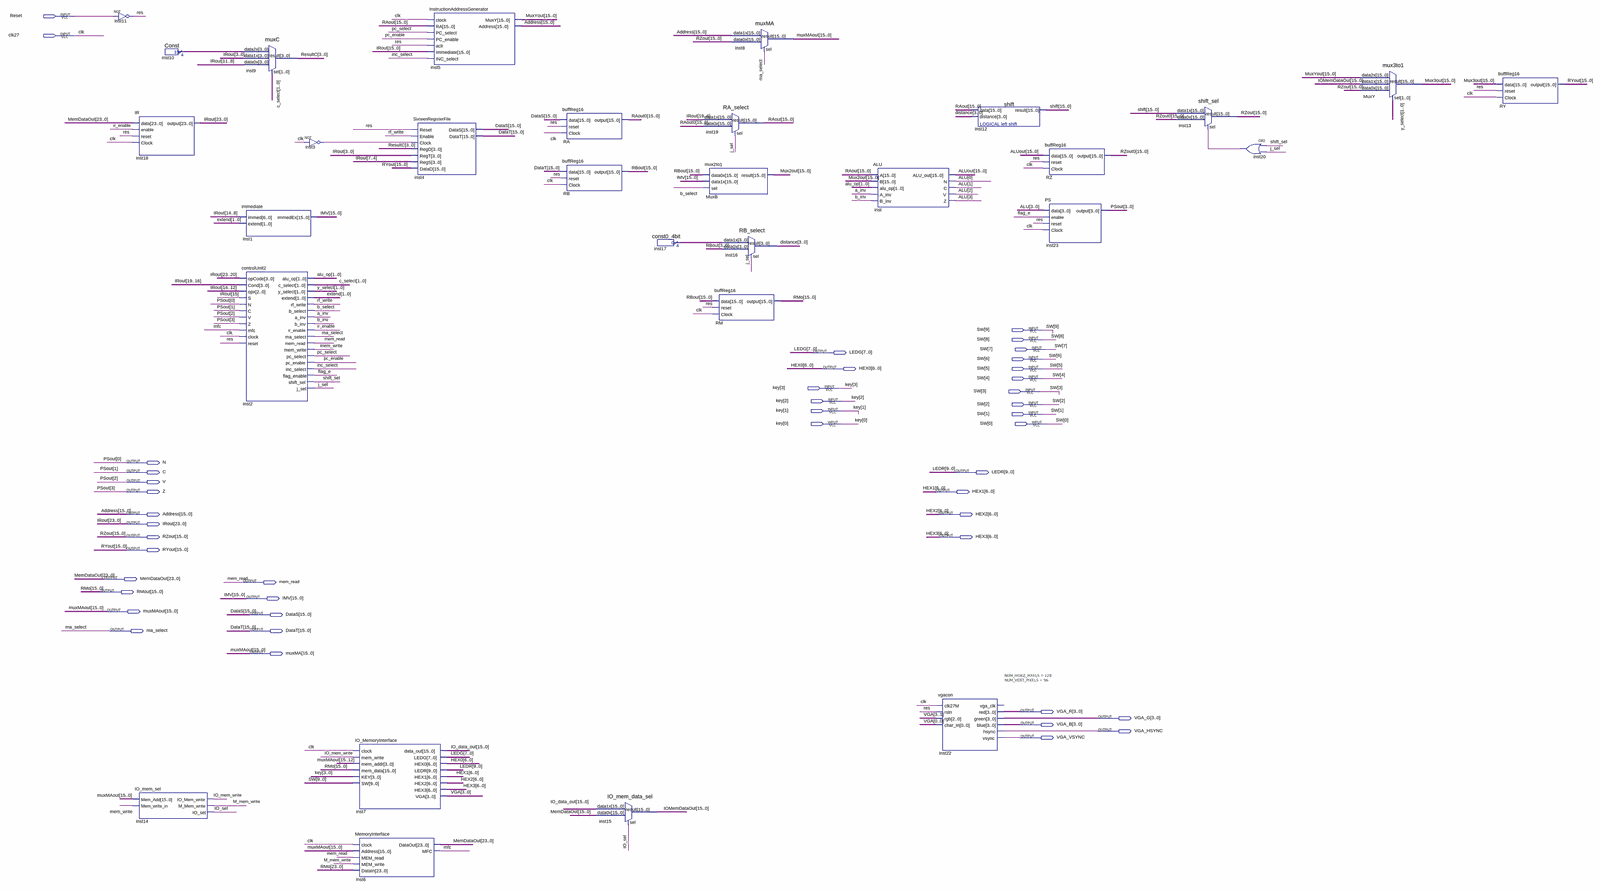
[diagram p0: schematic sheet, whole]
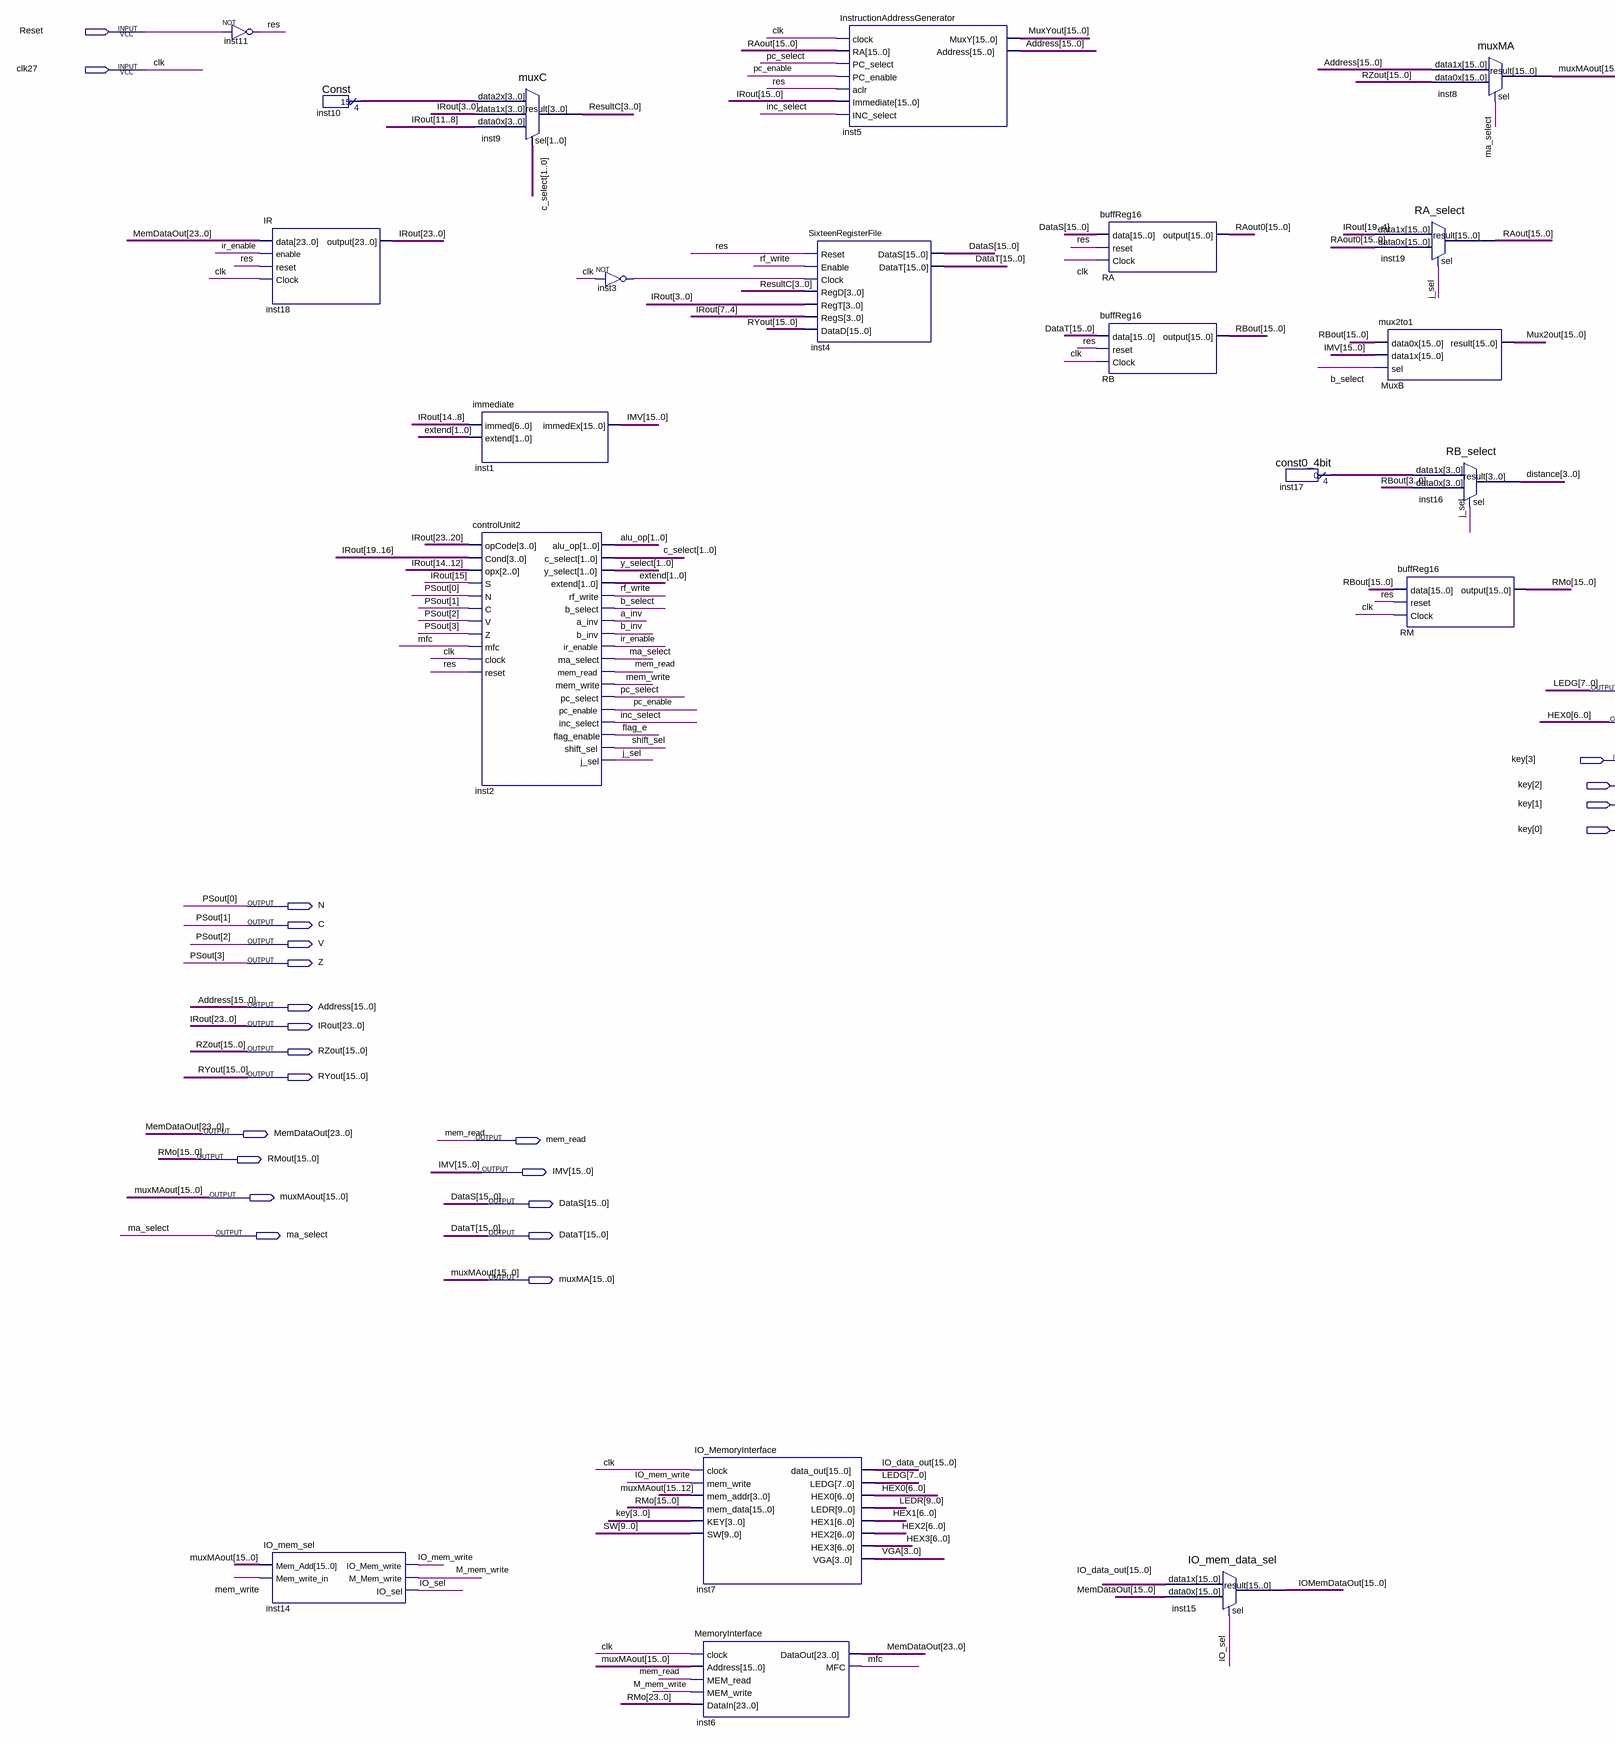
[diagram p1: schematic sheet, left part]
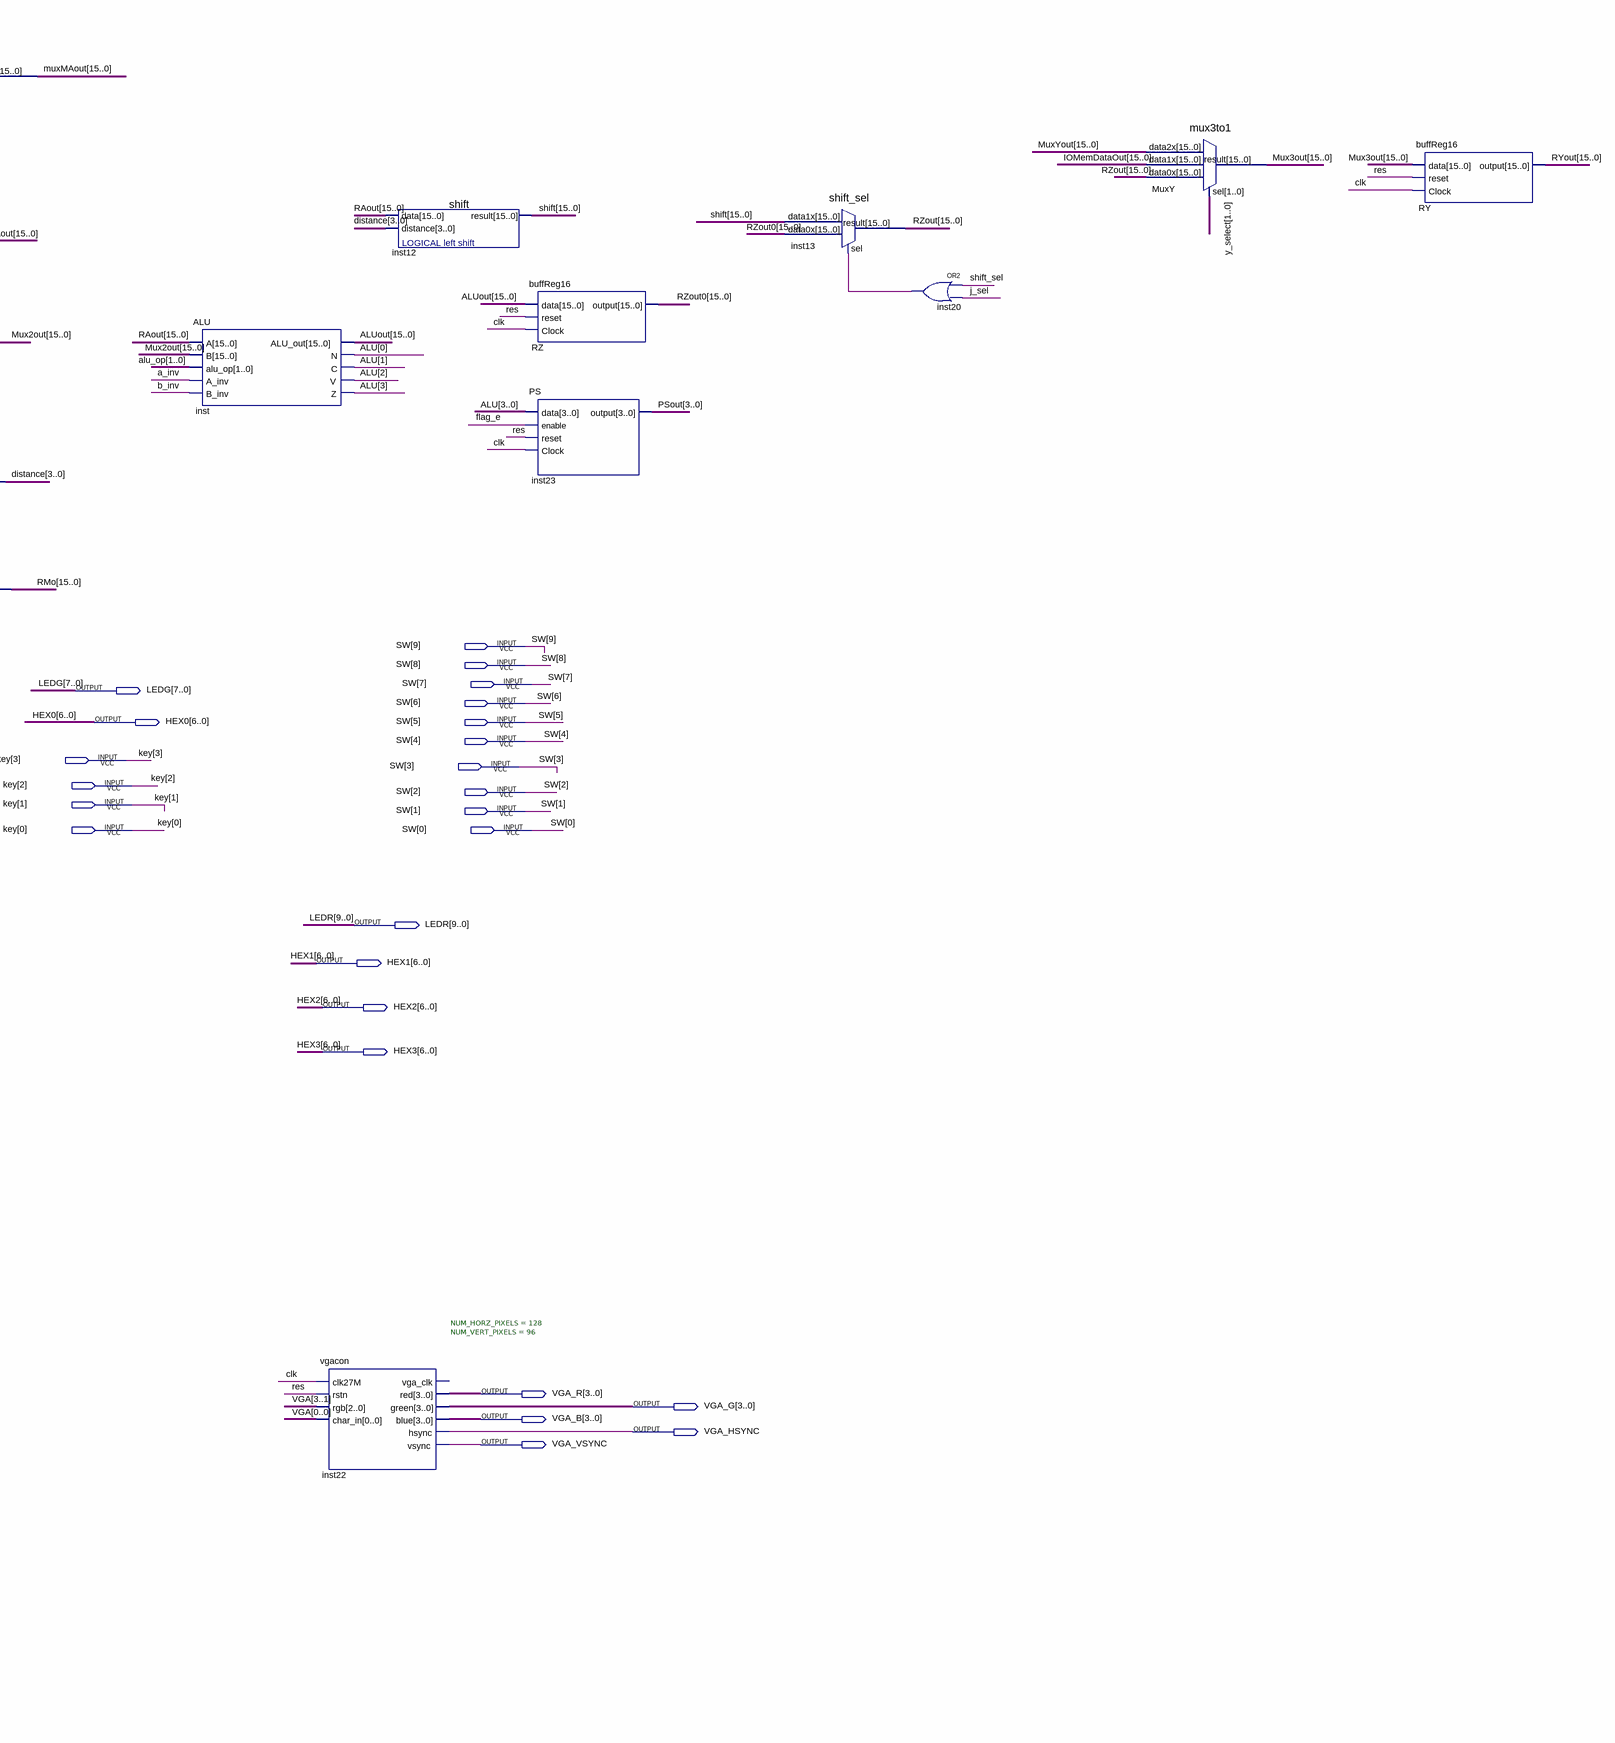
[diagram p2: schematic sheet, right part]
// Quartus schematic Part3.bdf as structural Verilog: 30 symbols, 44 pins
module Part3 (
  input  Reset,
  input  clk27,
  input  [9:0] SW,
  input  [3:0] key,
  output [7:0] LEDG,
  output [6:0] HEX0,
  output N,
  output C,
  output [9:0] LEDR,
  output V,
  output Z,
  output [6:0] HEX1,
  output [15:0] Address,
  output [6:0] HEX2,
  output [23:0] IRout,
  output [15:0] RZout,
  output [6:0] HEX3,
  output [15:0] RYout,
  output [23:0] MemDataOut,
  output mem_read,
  output [15:0] RMout,
  output [15:0] IMV,
  output [15:0] muxMAout,
  output [15:0] DataS,
  output ma_select,
  output [15:0] DataT,
  output [15:0] muxMA,
  output [3:0] VGA_R,
  output [3:0] VGA_G,
  output [3:0] VGA_B,
  output VGA_HSYNC,
  output VGA_VSYNC
);

  wire a_inv, b_inv, b_select, flag_e, inc_select, inst3_out, inst20_out, IO_mem_write, IO_sel, ir_enable,
       j_sel, M_mem_write, mem_write, mfc, pc_enable, pc_select, res, rf_write, shift_sel;
  wire [1:0] alu_op, c_select, extend, y_select;
  wire [3:0] ALU, distance, inst10_result, inst17_result, ResultC, VGA;
  wire [15:0] ALUout, IO_data_out, IOMemDataOut, Mux2out, Mux3out, MuxYout, RAout, RAout0, RBout, RZout0,
       shift;
  wire [23:16] RMo;

  not inst11 (res, Reset);
  IR inst18 (.data(MemDataOut), .enable(ir_enable), .reset(res), .Clock(clk27), .\output (IRout));
  IO_mem_sel inst14 (
    .Mem_Add(muxMA), .Mem_write_in(mem_write), .IO_Mem_write(IO_mem_write), .M_Mem_write(M_mem_write),
    .IO_sel(IO_sel));
  Const inst10 (.result(inst10_result));
  muxC inst9 (.data2x(inst10_result), .data1x(IRout[3:0]), .data0x(IRout[11:8]), .sel(c_select), .result(ResultC));
  immediate inst1 (.immed(IRout[14:8]), .extend(extend), .immedEx(IMV));
  controlUnit2 inst2 (
    .opCode(IRout[23:20]), .Cond(IRout[19:16]), .opx(IRout[14:12]), .S(IRout[15]), .N(N), .C(C), .V(V),
    .Z(Z), .mfc(mfc), .clock(clk27), .reset(res), .alu_op(alu_op), .c_select(c_select), .y_select(y_select),
    .extend(extend), .rf_write(rf_write), .b_select(b_select), .a_inv(a_inv), .b_inv(b_inv),
    .ir_enable(ir_enable), .ma_select(ma_select), .mem_read(mem_read), .mem_write(mem_write),
    .pc_select(pc_select), .pc_enable(pc_enable), .inc_select(inc_select), .flag_enable(flag_e),
    .shift_sel(shift_sel), .j_sel(j_sel));
  not inst3 (inst3_out, clk27);
  IO_MemoryInterface inst7 (
    .clock(clk27), .mem_write(IO_mem_write), .mem_addr(muxMA[15:12]), .mem_data(RMout), .KEY(key), .SW(SW),
    .data_out(IO_data_out), .LEDG(LEDG), .HEX0(HEX0), .LEDR(LEDR), .HEX1(HEX1), .HEX2(HEX2), .HEX3(HEX3),
    .VGA(VGA));
  MemoryInterface inst6 (
    .clock(clk27), .Address(muxMA), .MEM_read(mem_read), .MEM_write(M_mem_write), .DataIn({RMo, RMout}),
    .DataOut(MemDataOut), .MFC(mfc));
  SixteenRegisterFile inst4 (
    .Reset(res), .Enable(rf_write), .Clock(inst3_out), .RegD(ResultC), .RegT(IRout[3:0]), .RegS(IRout[7:4]),
    .DataD(RYout), .DataS(DataS), .DataT(DataT));
  InstructionAddressGenerator inst5 (
    .clock(clk27), .RA(RAout), .PC_select(pc_select), .PC_enable(pc_enable), .aclr(res),
    .Immediate(IRout[15:0]), .INC_select(inc_select), .MuxY(MuxYout), .Address(Address));
  buffReg16 RA (.data(DataS), .reset(res), .Clock(clk27), .\output (RAout0));
  buffReg16 RB (.data(DataT), .reset(res), .Clock(clk27), .\output (RBout));
  IO_mem_data_sel inst15 (.data1x(IO_data_out), .data0x(MemDataOut[15:0]), .sel(IO_sel), .result(IOMemDataOut));
  const0_4bit inst17 (.result(inst17_result));
  RA_select inst19 (.data1x(IRout[19:4]), .data0x(RAout0), .sel(j_sel), .result(RAout));
  mux2to1 MuxB (.data0x(RBout), .data1x(IMV), .sel(b_select), .result(Mux2out));
  RB_select inst16 (.data1x(inst17_result), .data0x(RBout[3:0]), .sel(j_sel), .result(distance));
  buffReg16 RM (.data(RBout), .reset(res), .Clock(clk27), .\output (RMout));
  muxMA inst8 (.data1x(Address), .data0x(RZout), .sel(ma_select), .result(muxMA));
  ALU inst (
    .A(RAout), .B(Mux2out), .alu_op(alu_op), .A_inv(a_inv), .B_inv(b_inv), .ALU_out(ALUout), .N(ALU[0]),
    .C(ALU[1]), .V(ALU[2]), .Z(ALU[3]));
  vgacon #(.NUM_HORZ_PIXELS(128), .NUM_VERT_PIXELS(96)) inst22 (
    .clk27M(clk27), .rstn(res), .rgb(VGA[3:1]), .char_in(VGA[0]), .red(VGA_R), .green(VGA_G), .blue(VGA_B),
    .hsync(VGA_HSYNC), .vsync(VGA_VSYNC));  // open: vga_clk
  shift inst12 (.data(RAout), .distance(distance), .result(shift));
  buffReg16 RZ (.data(ALUout), .reset(res), .Clock(clk27), .\output (RZout0));
  PS inst23 (.data(ALU), .enable(flag_e), .reset(res), .Clock(clk27), .\output ({Z, V, C, N}));
  shift_sel inst13 (.data1x(shift), .data0x(RZout0), .sel(inst20_out), .result(RZout));
  or inst20 (inst20_out, shift_sel, j_sel);
  mux3to1 MuxY (.data2x(MuxYout), .data1x(IOMemDataOut), .data0x(RZout), .sel(y_select), .result(Mux3out));
  buffReg16 RY (.data(Mux3out), .reset(res), .Clock(clk27), .\output (RYout));

  assign muxMAout = muxMA;

  // Other names for the same wires on the sheet: clk = clk27; PSout[3:0] = {Z, V, C, N}; RMo[15:0] = RMout
endmodule
